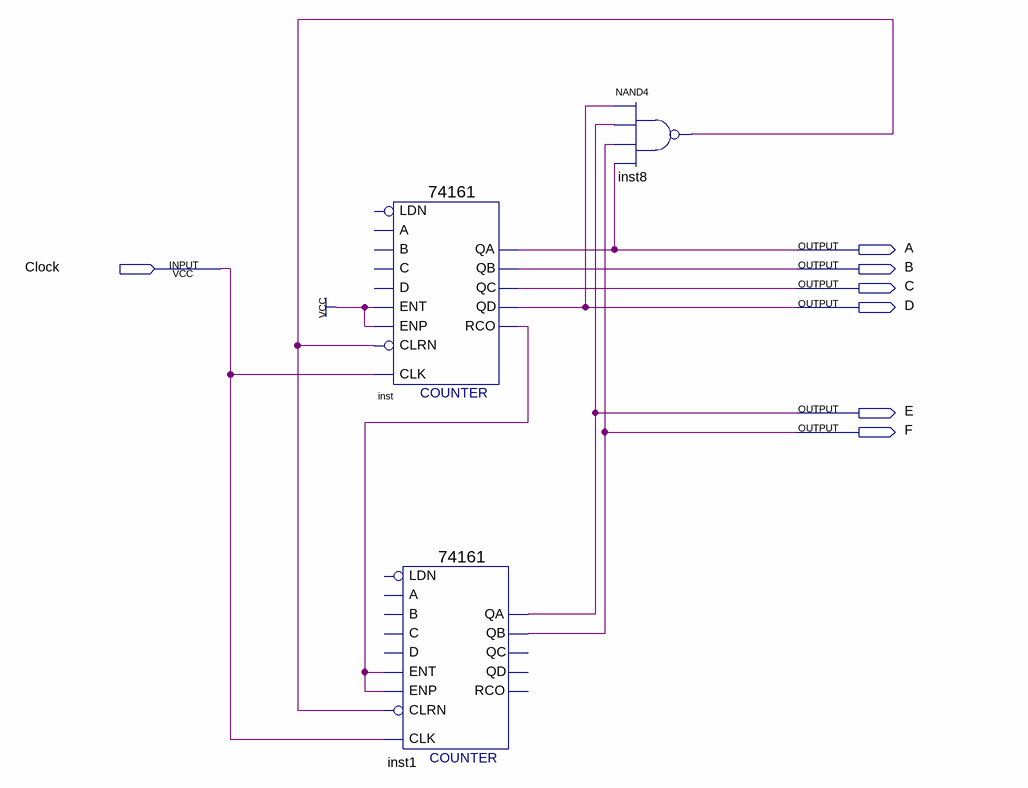
[diagram p0: schematic sheet]
// Quartus schematic 2.bdf as structural Verilog: 3 symbols, 7 pins
module \2  (
  input  Clock,
  output A,
  output B,
  output C,
  output D,
  output E,
  output F
);

  wire inst8_out, inst_rco;

  \74161  inst (
    .CLRN(inst8_out), .CLK(Clock), .ENP(1'b1), .ENT(1'b1), .QD(D), .QC(C), .QB(B), .QA(A), .RCO(inst_rco));  // open: LDN, A, D, B, C
  \74161  inst1 (
    .CLRN(inst8_out), .CLK(Clock), .ENP(inst_rco), .ENT(inst_rco), .QB(F), .QA(E));  // open: LDN, A, D, B, C, QD, QC, RCO
  nand inst8 (inst8_out, D, E, F, A);
endmodule
